# Altium schematic sheet 04-ANDStatusLed.SchDoc
size A4
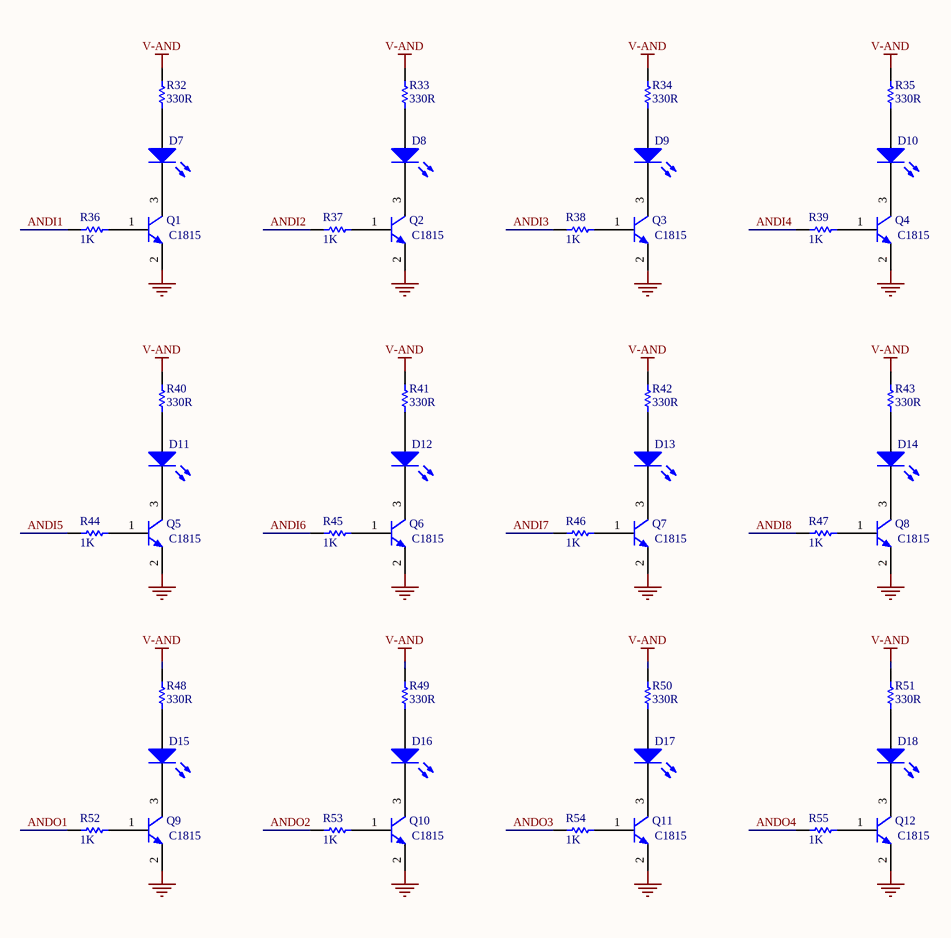
[diagram p0: 04-ANDStatusLed.SchDoc]

## Parts
D7  LED  [LED-3528]  (value not drawn)
D8  LED  [LED-3528]  (value not drawn)
D9  LED  [LED-3528]  (value not drawn)
D10  LED  [LED-3528]  (value not drawn)
D11  LED  [LED-3528]  (value not drawn)
D12  LED  [LED-3528]  (value not drawn)
D13  LED  [LED-3528]  (value not drawn)
D14  LED  [LED-3528]  (value not drawn)
D15  LED  [LED-3528]  (value not drawn)
D16  LED  [LED-3528]  (value not drawn)
D17  LED  [LED-3528]  (value not drawn)
D18  LED  [LED-3528]  (value not drawn)
Q1  value C1815  [SOT23-321]  (hidden comment: C1815-SMD)
Q2  value C1815  [SOT23-321]  (hidden comment: C1815-SMD)
Q3  value C1815  [SOT23-321]  (hidden comment: C1815-SMD)
Q4  value C1815  [SOT23-321]  (hidden comment: C1815-SMD)
Q5  value C1815  [SOT23-321]  (hidden comment: C1815-SMD)
Q6  value C1815  [SOT23-321]  (hidden comment: C1815-SMD)
Q7  value C1815  [SOT23-321]  (hidden comment: C1815-SMD)
Q8  value C1815  [SOT23-321]  (hidden comment: C1815-SMD)
Q9  value C1815  [SOT23-321]  (hidden comment: C1815-SMD)
Q10  value C1815  [SOT23-321]  (hidden comment: C1815-SMD)
Q11  value C1815  [SOT23-321]  (hidden comment: C1815-SMD)
Q12  value C1815  [SOT23-321]  (hidden comment: C1815-SMD)
R32  330R  [R-0805]
R33  330R  [R-0805]
R34  330R  [R-0805]
R35  330R  [R-0805]
R36  1K  [R-0805]
R37  1K  [R-0805]
R38  1K  [R-0805]
R39  1K  [R-0805]
R40  330R  [R-0805]
R41  330R  [R-0805]
R42  330R  [R-0805]
R43  330R  [R-0805]
R44  1K  [R-0805]
R45  1K  [R-0805]
R46  1K  [R-0805]
R47  1K  [R-0805]
R48  330R  [R-0805]
R49  330R  [R-0805]
R50  330R  [R-0805]
R51  330R  [R-0805]
R52  1K  [R-0805]
R53  1K  [R-0805]
R54  1K  [R-0805]
R55  1K  [R-0805]

## Nets
GND: Q1.2(E) Q2.2(E) Q3.2(E) Q4.2(E) Q5.2(E) Q6.2(E) Q7.2(E) Q8.2(E) Q9.2(E) Q10.2(E) Q11.2(E) Q12.2(E)
V-AND: R32.2 R33.2 R34.2 R35.2 R40.2 R41.2 R42.2 R43.2 R48.2 R49.2 R50.2 R51.2
ANDI1: R36.2
ANDI2: R37.2
ANDI3: R38.2
ANDI4: R39.2
ANDI5: R44.2
ANDI6: R45.2
ANDI7: R46.2
ANDI8: R47.2
ANDO1: R52.2
ANDO2: R53.2
ANDO3: R54.2
ANDO4: R55.2
NetD7_1: D7.1(A) R32.1
NetD7_2: D7.2(K) Q1.3(C)
NetD8_1: D8.1(A) R33.1
NetD8_2: D8.2(K) Q2.3(C)
NetD9_1: D9.1(A) R34.1
NetD9_2: D9.2(K) Q3.3(C)
NetD10_1: D10.1(A) R35.1
NetD10_2: D10.2(K) Q4.3(C)
NetD11_1: D11.1(A) R40.1
NetD11_2: D11.2(K) Q5.3(C)
NetD12_1: D12.1(A) R41.1
NetD12_2: D12.2(K) Q6.3(C)
NetD13_1: D13.1(A) R42.1
NetD13_2: D13.2(K) Q7.3(C)
NetD14_1: D14.1(A) R43.1
NetD14_2: D14.2(K) Q8.3(C)
NetD15_1: D15.1(A) R48.1
NetD15_2: D15.2(K) Q9.3(C)
NetD16_1: D16.1(A) R49.1
NetD16_2: D16.2(K) Q10.3(C)
NetD17_1: D17.1(A) R50.1
NetD17_2: D17.2(K) Q11.3(C)
NetD18_1: D18.1(A) R51.1
NetD18_2: D18.2(K) Q12.3(C)
NetQ1_1: Q1.1(B) R36.1
NetQ2_1: Q2.1(B) R37.1
NetQ3_1: Q3.1(B) R38.1
NetQ4_1: Q4.1(B) R39.1
NetQ5_1: Q5.1(B) R44.1
NetQ6_1: Q6.1(B) R45.1
NetQ7_1: Q7.1(B) R46.1
NetQ8_1: Q8.1(B) R47.1
NetQ9_1: Q9.1(B) R52.1
NetQ10_1: Q10.1(B) R53.1
NetQ11_1: Q11.1(B) R54.1
NetQ12_1: Q12.1(B) R55.1

## Library data of the parts
D7-D18 = LED2: Typical RED, GREEN, YELLOW, AMBER GaAs LED; Published: 8-Jun-2000; LatestRevisionDate: 17-Jul-2002; LatestRevisionNote: Re-released for DXP Platform.; PackageVersion: Feb-2002; PackageReference: 3.2X1.6X1.1; Publisher: Altium Limited; PackageDescription: SM LED; 2 Flat Leads
Q1-Q12 = NPN: NPN Bipolar Transistor; Published: 8-Jun-2000; LatestRevisionDate: 17-Jul-2002; LatestRevisionNote: Re-released for DXP Platform.; PackageReference: TO-226-AA; PackageDescription: TO, Flat Index; 3 In-Line, Axial Leads; Body Dia. 4.8mm; Leads 0.55 x 0.51 mm (max); Code_JEDEC: TO-226-AA
R32-R55 = Res1: Resistor; Published: 8-Jun-2000; LatestRevisionDate: 17-Jul-2002; LatestRevisionNote: Re-released for DXP Platform.; PackageReference: AXIAL-0.3; Publisher: Altium Limited; PackageDescription: Axial Device, Thru-Hole; 2 Leads; 0.3 in Pin Spacing
  R32-R35 R40-R43 R48-R51: Value: 330R
  R36-R39 R44-R47 R52-R55: Value: 1K